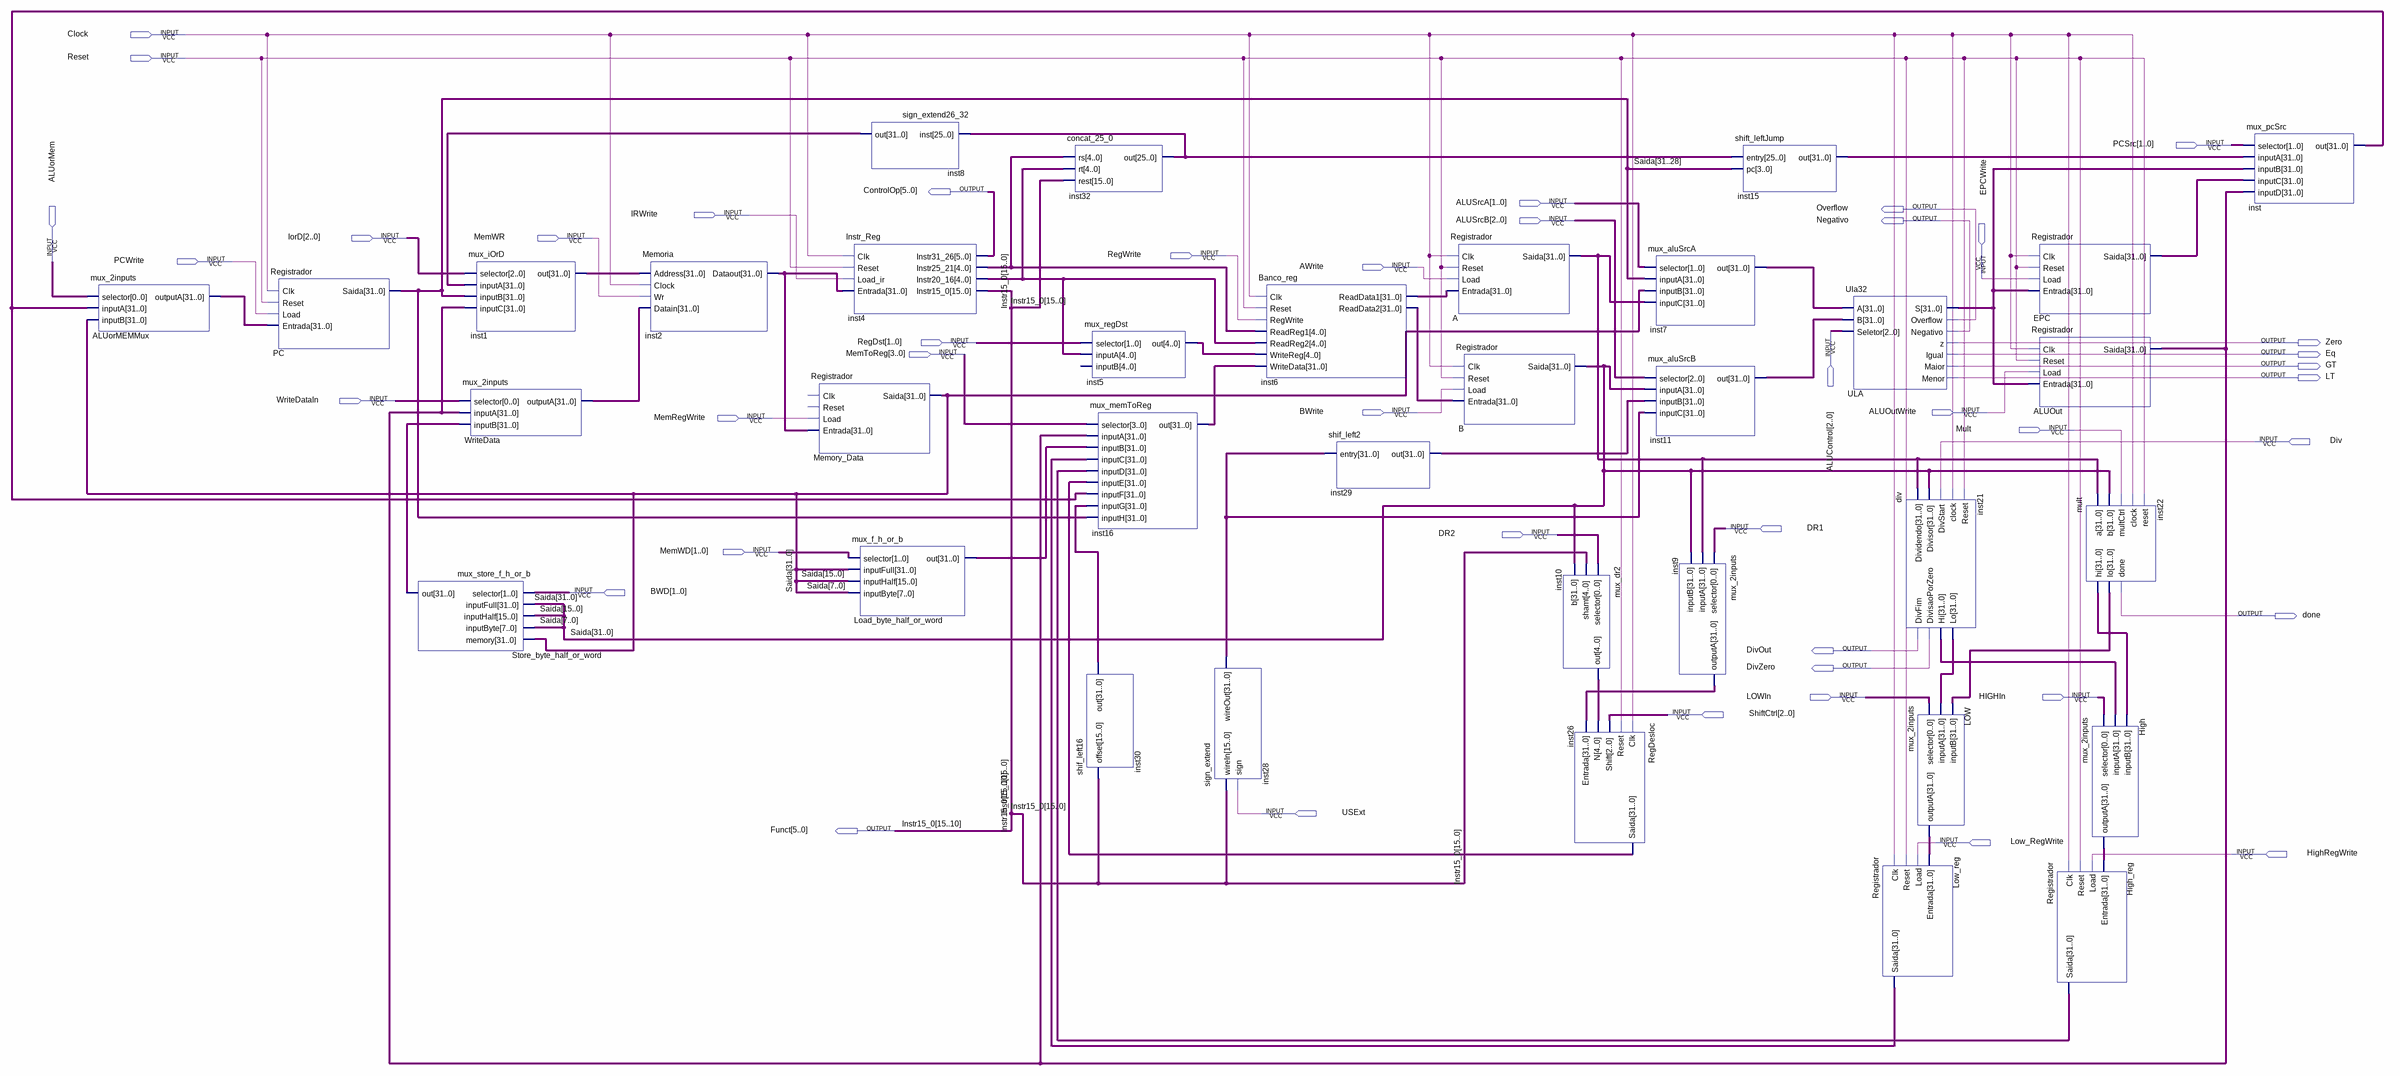
[diagram p0: schematic sheet]
// Quartus schematic UnidadeProcessamento.bdf as structural Verilog: 35 symbols, 43 pins
module UnidadeProcessamento (
  input  Clock,
  input  Reset,
  input  [1:0] PCSrc,
  input  [1:0] ALUSrcA,
  input  IRWrite,
  input  [2:0] ALUSrcB,
  input  [2:0] IorD,
  input  MemWR,
  input  RegWrite,
  input  ALUorMem,
  input  PCWrite,
  input  AWrite,
  input  EPCWrite,
  input  [2:0] ALUControl,
  input  [1:0] RegDst,
  input  [3:0] MemToReg,
  input  WriteDataIn,
  input  BWrite,
  input  ALUOutWrite,
  input  MemRegWrite,
  input  Mult,
  input  Div,
  input  DR1,
  input  DR2,
  input  [1:0] MemWD,
  input  [1:0] BWD,
  input  LOWIn,
  input  HIGHIn,
  input  [2:0] ShiftCtrl,
  input  USExt,
  input  Low_RegWrite,
  input  HighRegWrite,
  output [5:0] ControlOp,
  output Overflow,
  output Negativo,
  output Zero,
  output Eq,
  output GT,
  output LT,
  output done,
  output DivOut,
  output DivZero,
  output [5:0] Funct
);

  wire [4:0] inst4_instr20_16, inst4_instr25_21, inst5_out, inst10_out;
  wire [9:0] Instr15_0;
  wire [25:0] inst32_out;
  wire [31:0] A_saida, ALUorMEMMux_outputa, ALUOut_saida, EPC_saida, High_outputa, High_reg_saida, inst1_out,
       inst2_dataout, inst6_readdata1, inst6_readdata2, inst7_out, inst8_out, inst9_outputa, inst11_out,
       inst15_out, inst16_out, inst21_hi, inst21_lo, inst22_hi, inst22_lo, inst26_saida, inst28_wireout,
       inst29_out, inst30_out, inst_out, Load_byte_half_or_word_out, LOW_outputa, Low_reg_saida, Saida,
       Store_byte_half_or_word_out, ULA_s, WriteData_outputa;

  mux_2inputs ALUorMEMMux (.selector(ALUorMem), .inputA(inst_out), .inputB(Saida), .outputA(ALUorMEMMux_outputa));
  Registrador PC (.Clk(Clock), .Reset(Reset), .Load(PCWrite), .Entrada(ALUorMEMMux_outputa), .Saida(Saida));
  mux_store_f_h_or_b Store_byte_half_or_word (
    .selector(BWD), .inputFull(Saida), .inputHalf(Saida[15:0]), .inputByte(Saida[7:0]), .memory(Saida),
    .out(Store_byte_half_or_word_out));
  mux_iOrD inst1 (.selector(IorD), .inputA(inst8_out), .inputB(Saida), .inputC(ALUOut_saida), .out(inst1_out));
  mux_2inputs WriteData (
    .selector(WriteDataIn), .inputA(ALUOut_saida), .inputB(Store_byte_half_or_word_out),
    .outputA(WriteData_outputa));
  Memoria inst2 (.Address(inst1_out), .Clock(Clock), .Wr(MemWR), .Datain(WriteData_outputa), .Dataout(inst2_dataout));
  Instr_Reg inst4 (
    .Clk(Clock), .Reset(Reset), .Load_ir(IRWrite), .Entrada(inst2_dataout), .Instr31_26(ControlOp),
    .Instr25_21(inst4_instr25_21), .Instr20_16(inst4_instr20_16), .Instr15_0({Funct, Instr15_0}));
  Registrador Memory_Data (.Load(MemRegWrite), .Entrada(inst2_dataout), .Saida(Saida));  // open: Clk, Reset
  sign_extend26_32 inst8 (.inst(inst32_out), .out(inst8_out));
  mux_f_h_or_b Load_byte_half_or_word (
    .selector(MemWD), .inputFull(Saida), .inputHalf(Saida[15:0]), .inputByte(Saida[7:0]),
    .out(Load_byte_half_or_word_out));
  concat_25_0 inst32 (.rs(inst4_instr25_21), .rt(inst4_instr20_16), .rest({Funct, Instr15_0}), .out(inst32_out));
  shif_left16 inst30 (.offset({Funct, Instr15_0}), .out(inst30_out));
  mux_regDst inst5 (.selector(RegDst), .inputA(inst4_instr20_16), .out(inst5_out));  // open: inputB
  mux_memToReg inst16 (
    .selector(MemToReg), .inputA(ALUOut_saida), .inputB(Load_byte_half_or_word_out), .inputC(Low_reg_saida),
    .inputD(High_reg_saida), .inputE(inst26_saida), .inputF(inst_out), .inputG(inst30_out), .inputH(Saida),
    .out(inst16_out));
  sign_extend inst28 (.wireIn({Funct, Instr15_0}), .sign(USExt), .wireOut(inst28_wireout));
  Banco_reg inst6 (
    .Clk(Clock), .Reset(Reset), .RegWrite(RegWrite), .ReadReg1(inst4_instr25_21),
    .ReadReg2(inst4_instr20_16), .WriteReg(inst5_out), .WriteData(inst16_out), .ReadData1(inst6_readdata1),
    .ReadData2(inst6_readdata2));
  shif_left2 inst29 (.entry(inst28_wireout), .out(inst29_out));
  Registrador A (.Clk(Clock), .Reset(Reset), .Load(AWrite), .Entrada(inst6_readdata1), .Saida(A_saida));
  Registrador B (.Clk(Clock), .Reset(Reset), .Load(BWrite), .Entrada(inst6_readdata2), .Saida(Saida));
  mux_dr2 inst10 (.selector(DR2), .shamt({Funct[0], Instr15_0[9:6]}), .b(Saida), .out(inst10_out));
  RegDesloc inst26 (
    .Clk(Clock), .Reset(Reset), .Shift(ShiftCtrl), .N(inst10_out), .Entrada(inst9_outputa),
    .Saida(inst26_saida));
  mux_aluSrcA inst7 (.selector(ALUSrcA), .inputA(Saida), .inputB(Saida), .inputC(A_saida), .out(inst7_out));
  mux_aluSrcB inst11 (
    .selector(ALUSrcB), .inputA(Saida), .inputB(inst29_out), .inputC(inst28_wireout), .out(inst11_out));
  mux_2inputs inst9 (.selector(DR1), .inputA(A_saida), .inputB(Saida), .outputA(inst9_outputa));
  shift_leftJump inst15 (.entry(inst32_out), .pc(Saida[31:28]), .out(inst15_out));
  Ula32 ULA (
    .A(inst7_out), .B(inst11_out), .Seletor(ALUControl), .S(ULA_s), .Overflow(Overflow), .Negativo(Negativo),
    .z(Zero), .Igual(Eq), .Maior(GT), .Menor(LT));
  div inst21 (
    .Dividendo(A_saida), .Divisor(Saida), .DivStart(Div), .clock(Clock), .Reset(Reset), .DivFim(DivOut),
    .DivisaoPorZero(DivZero), .Hi(inst21_hi), .Lo(inst21_lo));
  mux_2inputs LOW (.selector(LOWIn), .inputA(inst21_lo), .inputB(inst22_lo), .outputA(LOW_outputa));
  Registrador Low_reg (.Clk(Clock), .Reset(Reset), .Load(Low_RegWrite), .Entrada(LOW_outputa), .Saida(Low_reg_saida));
  Registrador EPC (.Clk(Clock), .Reset(Reset), .Load(EPCWrite), .Entrada(ULA_s), .Saida(EPC_saida));
  Registrador ALUOut (.Clk(Clock), .Reset(Reset), .Load(ALUOutWrite), .Entrada(ULA_s), .Saida(ALUOut_saida));
  Registrador High_reg (
    .Clk(Clock), .Reset(Reset), .Load(HighRegWrite), .Entrada(High_outputa), .Saida(High_reg_saida));
  mult inst22 (
    .a(A_saida), .b(Saida), .multCtrl(Mult), .clock(Clock), .reset(Reset), .hi(inst22_hi), .lo(inst22_lo),
    .done(done));
  mux_2inputs High (.selector(HIGHIn), .inputA(inst21_hi), .inputB(inst22_hi), .outputA(High_outputa));
  mux_pcSrc inst (
    .selector(PCSrc), .inputA(inst15_out), .inputB(ULA_s), .inputC(EPC_saida), .inputD(ALUOut_saida),
    .out(inst_out));

  // Other names for the same wires on the sheet: Instr15_0[15:10] = Funct
endmodule
